# EAGLE design BYOB-BoosterPack-Template (EAGLE 6.5.0)
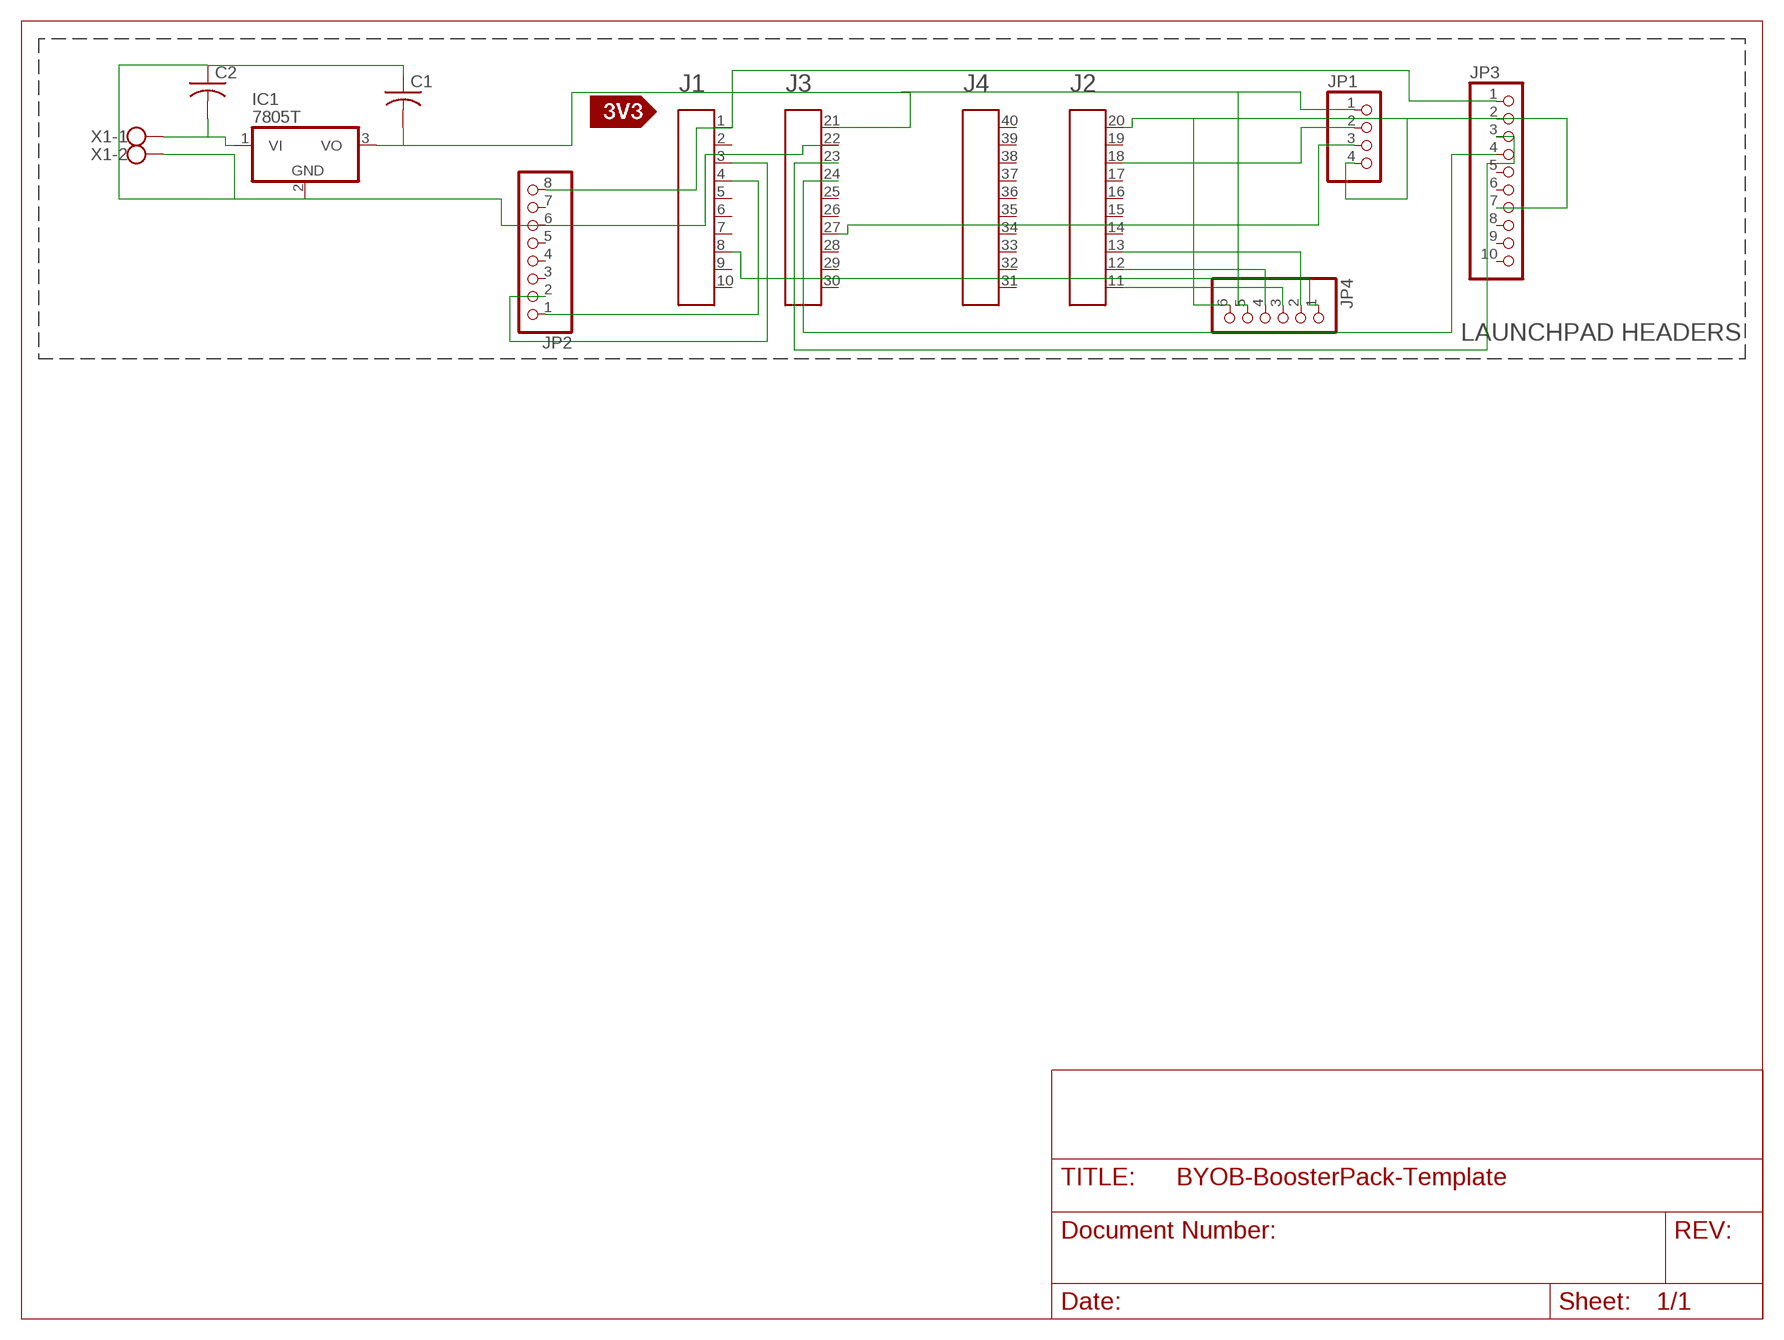
[diagram p0: schematic, sheet 1]

## Parts
A1  HEADER4X10-BOOSTERPACK  [4X10-BOOSTERPACK]
C1  C-US025-025X050  [C025-025X050]
C2  C-US025-025X050  [C025-025X050]
IC1  7805T  [TO220H]
JP1  PINHD-1X4  [1X04]
JP2  PINHD-1X8  [1X08]
JP3  PINHD-1X10  [1X10]
JP4  PINHD-1X6  [1X06]
U$3  SILK_3V3_TAG  [SILK_3V3_TAG]
X1  W237-102  [W237-102]

## Nets
GND: A1.20 A1.22 C1.1 C2.1 IC1.2(GND) JP1.4 JP2.6 JP3.2 JP3.7 JP4.6 X1.2
N$1: A1.21 C1.2 IC1.3(VO) JP1.1 JP4.5
N$2: A1.4 JP2.1
N$3: A1.18 JP1.2
N$4: A1.27 JP1.3
N$6: A1.1 JP2.8 JP3.1
N$7: A1.3 JP2.2
N$9: A1.24 JP3.4
N$10: A1.23 JP3.3
N$11: A1.12 JP4.4
N$12: A1.11 JP4.3
N$13: A1.13 JP4.2
N$14: A1.8 JP4.1
N$16: C2.2 IC1.1(VI) X1.1
Unconnected: A1.2 A1.5 A1.6 A1.7 A1.9 A1.10 A1.14 A1.15 A1.16 A1.17 A1.19 A1.25 A1.26 A1.28 A1.29 A1.30 A1.31 A1.32 A1.33 A1.34 A1.35 A1.36 A1.37 A1.38 A1.39 A1.40 JP2.3 JP2.4 JP2.5 JP2.7 JP3.5 JP3.6 JP3.8 JP3.9 JP3.10

## Notes on the sheet
- LAUNCHPAD HEADERS

## Library data of the parts
A1 = Public_BP_Library:HEADER4X10-BOOSTERPACK
C1 C2 = adafruit:C-US: CAPACITOR, American symbol
IC1 = adafruit:78*: Positive VOLTAGE REGULATOR Added bigger pads to the TO-92 package
JP1 = pinhead:PINHD-1X4: PIN HEADER
JP2 = pinhead:PINHD-1X8: PIN HEADER
JP3 = pinhead:PINHD-1X10: PIN HEADER
JP4 = pinhead:PINHD-1X6: PIN HEADER
U$3 = Public_BP_Library:SILK_3V3_TAG
X1 = con-wago-500:W237-102: WAGO SCREW CLAMP; MPN: 237-102; OC_FARNELL: unknown; OC_NEWARK: 70K9898

## Board
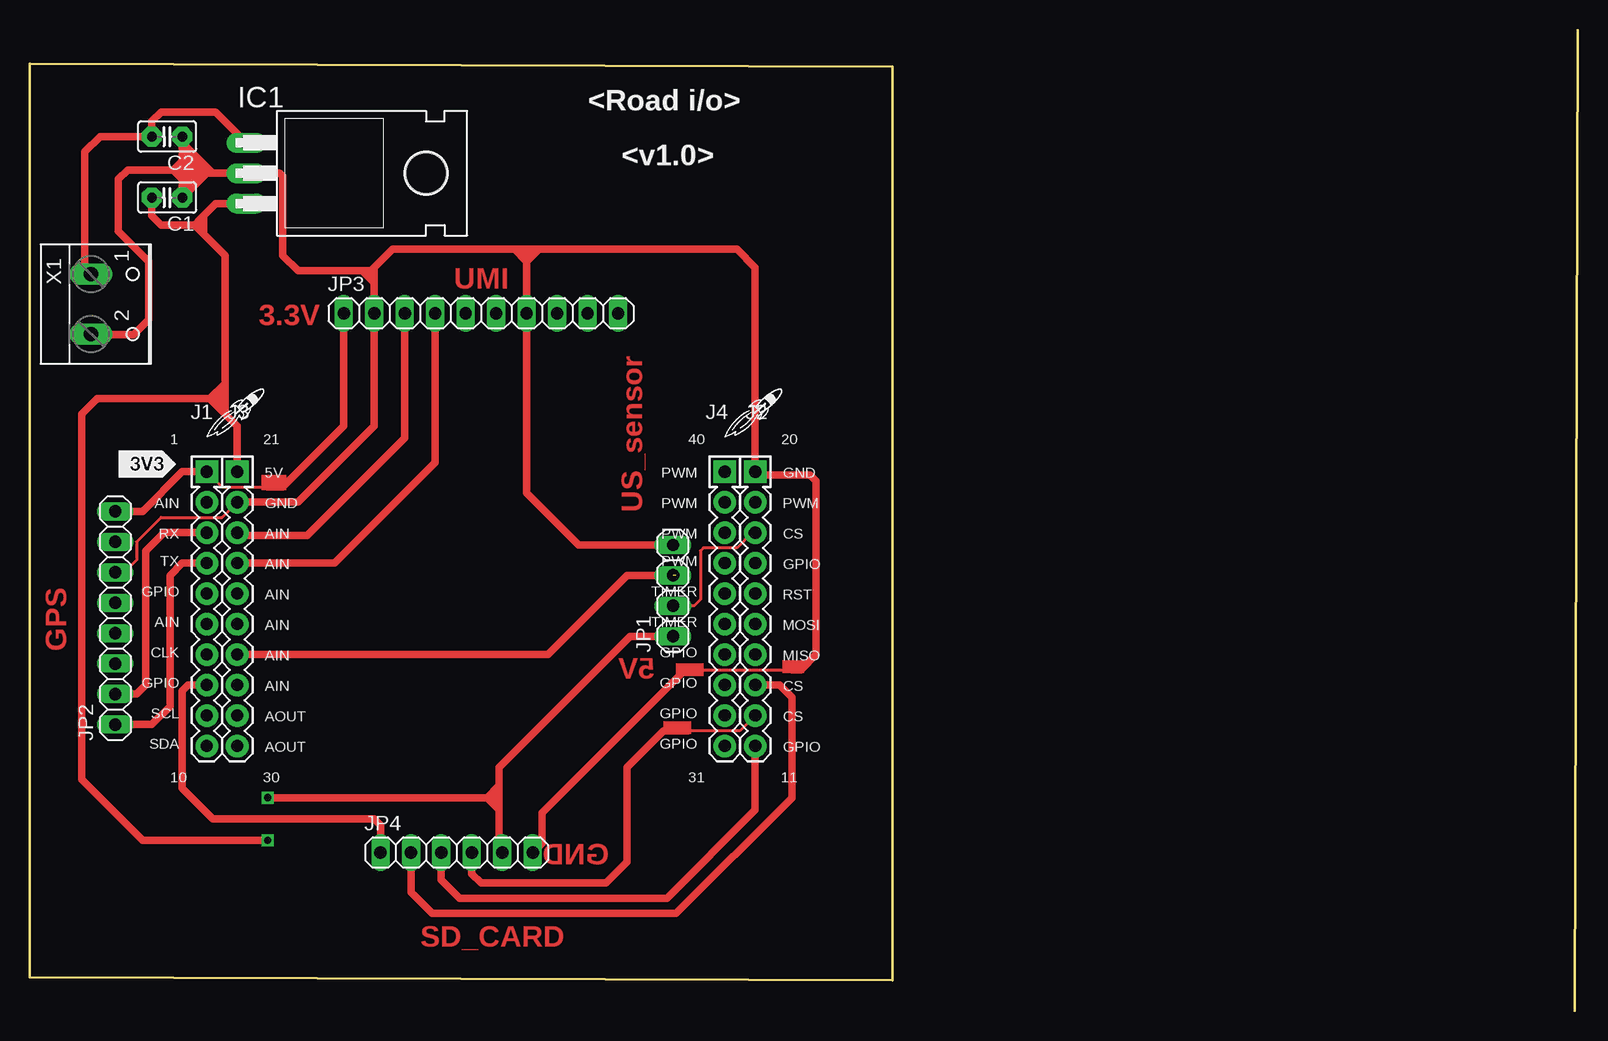
[diagram p1: board, top side]
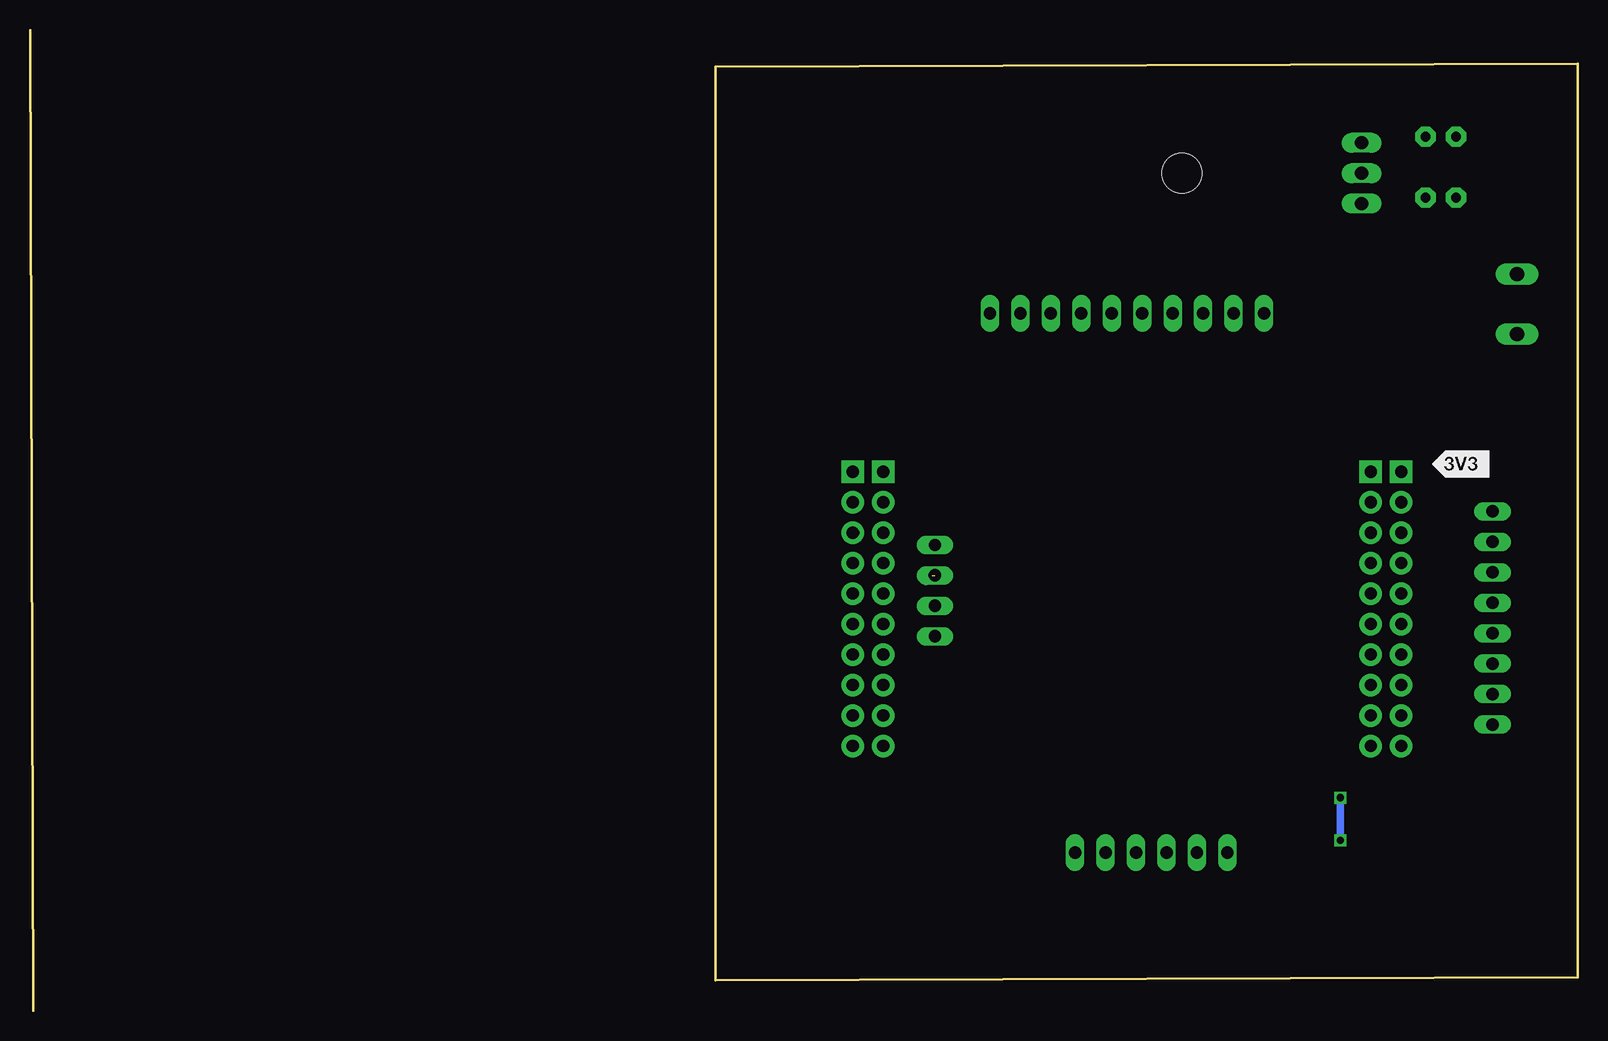
[diagram p2: board, bottom side, seen from below]

Size 129.03 x 81.79 mm. Coordinates in mm from the lower left corner, seen from the top.
Outline: 128.78,0 129.03,81.79
Outline: 0,2.79 71.88,2.54 71.88,78.74 0,78.99 0,2.79
Copper layers (1*16): Top 0.035mm / dielectric 1.5mm / Bottom 0.035mm
Design rules "default": minimum track width 10mil, minimum drill 24mil, track to track 8mil, track to pad 8mil, pad to pad 8mil, via to via 8mil, smd to smd 8mil, copper to edge 40mil, drill to drill 8mil, minimum pad ring 10mil, minimum via ring 8mil, stop-mask expansion 4mil, vias tented up to drill 0mil, thermal gap 10mil

### Footprints (pad centres in the part's own frame; a part is rotated, then mirrored left to right if it is on the bottom)
4X10-BOOSTERPACK = drill 1.016 pad 1.88 square: 1 0,10.16; 20 45.72,10.16; 21 2.54,10.16; 40 43.18,10.16 | drill 1.016 pad 1.88: 2 0,7.62; 3 0,5.08; 4 0,2.54; 5 0,0; 6 0,-2.54; 7 0,-5.08; 8 0,-7.62; 9 0,-10.16; 10 0,-12.7; 11 45.72,-12.7; 12 45.72,-10.16; 13 45.72,-7.62; 14 45.72,-5.08; 15 45.72,-2.54; 16 45.72,0; 17 45.72,2.54; 18 45.72,5.08; 19 45.72,7.62; 22 2.54,7.62; 23 2.54,5.08; 24 2.54,2.54; 25 2.54,0; 26 2.54,-2.54; 27 2.54,-5.08; 28 2.54,-7.62; 29 2.54,-10.16; 30 2.54,-12.7; 31 43.18,-12.7; 32 43.18,-10.16; 33 43.18,-7.62; 34 43.18,-5.08; 35 43.18,-2.54; 36 43.18,0; 37 43.18,2.54; 38 43.18,5.08; 39 43.18,7.62
C025-025X050 = drill 0.813 pad 1.676 octagon: 1 -1.27,0; 2 1.27,0
TO220H = drill 1.118 long: 1 -2.54,-10.16; 2 0,-10.16; 3 2.54,-10.16 | hole 3.302: 0,4.826
1X04 = drill 1.016 long: 1 -3.81,0; 2 -1.27,0; 3 1.27,0; 4 3.81,0
1X08 = drill 1.016 long: 1 -8.89,0; 2 -6.35,0; 3 -3.81,0; 4 -1.27,0; 5 1.27,0; 6 3.81,0; 7 6.35,0; 8 8.89,0
1X10 = drill 1.016 long: 1 -11.43,0; 2 -8.89,0; 3 -6.35,0; 4 -3.81,0; 5 -1.27,0; 6 1.27,0; 7 3.81,0; 8 6.35,0; 9 8.89,0; 10 11.43,0
1X06 = drill 1.016 long: 1 -6.35,0; 2 -3.81,0; 3 -1.27,0; 4 1.27,0; 5 3.81,0; 6 6.35,0
W237-102 = drill 1.194 long: 1 -2.5,-1.27; 2 2.5,-1.27

### Placement (x,y rotation side)
A1  14.73,34.8 0 top
C1  11.43,67.82 180 top
C2  11.43,72.9 180 top
IC1  28.19,69.85 270 top
JP1  53.59,35.05 90 top
JP2  7.11,32.77 90 top
JP3  37.59,58.17 0 top
JP4  35.56,13.21 0 top
U$1  [LOGO-ROCKET]  60.45,50.04 0 top
U$2  [LOGO-ROCKET]  17.27,50.04 0 top
U$3  7.37,44.45 0 top
X1  6.35,58.93 270 top

### Tracks (layer width: path | path; a pad name or v marks a point on that pad's centre or on a via)
GND
  Top 0.254: 7.87,36.58 8.89,37.59 8.89,39.12 10.92,41.15 16,41.15 A1.22 | 54.61,28.45 63.5,28.45
  Top 0.61: A1.22 22.35,42.42 28.7,48.77 JP3.2 | JP1.4 45.72,38.86 41.4,43.18 JP3.7 41.4,62.48 | JP4.6 42.67,13.97 42.67,16.51 54.61,28.45 | 63.5,28.45 64.26,28.45 65.53,29.72 65.53,44.2 65.02,44.7 60.71,44.7 A1.20 60.45,61.98 58.93,63.5 42.42,63.5 | 40.39,63.5 30.23,63.5 28.7,61.98 | 40.39,63.5 41.4,62.48 | 15.24,69.85 IC1.2 20.83,69.85 21.08,69.6 21.08,62.99 22.35,61.72 27.69,61.72 | 15.24,69.85 14.73,69.85 C1.1 12.7,69.34 | C2.1 12.7,72.39 | 12.7,72.39 13.21,71.88 | 13.21,71.88 15.24,69.85 | 12.7,69.34 11.94,70.1 | 11.94,70.1 8.13,70.1 7.37,69.34 7.37,65.02 9.91,62.48 9.91,57.66 8.64,56.39 5.12,56.39 X1.2 | 27.69,61.72 28.7,60.71 JP3.2 | JP3.2 28.7,61.98 | 27.69,61.72 28.45,61.72 28.7,61.98 | 12.7,72.39 12.7,70.87 | 12.7,70.87 12.7,70.1 | 12.7,70.1 12.7,69.34 | 13.21,71.88 13.21,68.58 12.95,68.33 | 11.94,70.1 12.7,70.1 | 11.94,70.1 12.7,70.87 | 41.4,62.48 42.42,63.5 | 40.39,63.5 41.4,63.5 | 41.4,63.5 42.42,63.5 | 41.4,63.5 41.4,62.74 | 7.87,36.58 JP2.6
N$1  (via drill 0.6)
  Top 0.61: JP1.1 50.04,31.24 39.12,20.32 39.12,18.8 | 16.26,49.78 17.27,48.77 A1.21 | 16.26,49.78 14.99,51.05 | 14.99,51.05 5.59,51.05 4.32,49.78 4.32,19.3 9.4,14.22 v19.81,14.22 | C1.2 10.16,66.29 10.92,65.53 13.72,65.53 | 13.72,65.53 14.22,66.04 | 14.22,66.04 14.48,66.29 | 14.48,66.29 15.49,67.31 IC1.3 | 14.99,51.05 16.26,52.32 | 16.26,52.32 16.26,62.99 14.48,64.77 | 14.22,65.02 13.72,65.53 | 39.12,17.78 39.12,18.8 | 39.12,17.78 39.12,16.76 | 39.12,16.76 39.12,13.46 JP4.5 | 14.22,66.04 14.22,65.02 | 14.22,65.02 14.48,64.77 | 14.48,64.77 14.48,66.29 | 16.26,52.32 16.26,49.78 | v19.81,17.78 38.1,17.78 | 38.1,17.78 39.12,17.78 | 38.1,17.78 39.12,18.8 | 38.1,17.78 39.12,16.76
  Bottom 0.61: v19.81,14.22 v19.81,17.78
N$2
  Top 0.61: JP2.1 10.16,23.88 11.68,25.4 11.68,36.32 12.7,37.34 A1.4
N$3  (via drill 0.6)
  Top 0.254: v60.2,39.88 58.93,38.61 56.13,38.61 55.88,38.35 55.88,34.29 55.37,33.78 JP1.2
  Bottom 0.254: A1.18 v60.2,39.88
N$4  (via drill 0.6)  (1 unrouted)
  Top 0.61: A1.27 43.18,29.72 49.78,36.32 v53.85,36.32
  Bottom 0.61: v53.85,36.32 54.36,35.81
N$5
  Top 0.61: 13.46,71.12 13.46,68.83
N$6
  Top 0.254: A1.1 16,43.69 19.81,43.69
  Top 0.61: JP2.8 9.4,41.66 12.7,44.96 A1.1 | 19.81,43.69 21.08,43.69 26.16,48.77 JP3.1
N$7
  Top 0.61: JP2.2 8.89,26.42 9.65,27.18 9.65,38.35 11.18,39.88 A1.3
N$8
  Top 0.61: 13.72,70.87 13.72,69.09
N$9
  Top 0.61: JP3.4 33.78,45.72 25.4,37.34 A1.24
N$10
  Top 0.61: JP3.3 31.24,47.75 23.11,39.62 17.53,39.62 A1.23
N$11
  Top 0.254: A1.12 59.18,23.37 54.86,23.37
  Top 0.61: 54.86,23.37 52.83,23.37 49.78,20.32 49.78,12.45 48.01,10.67 37.59,10.67 36.83,11.43 JP4.4
N$12
  Top 0.61: 34.29,13.97 JP4.3 34.29,10.92 35.81,9.4 53.09,9.4 60.45,16.76 A1.11
N$13
  Top 0.61: A1.13 62.48,27.18 63.5,26.16 63.5,17.78 53.85,8.13 33.53,8.13 31.75,9.91 JP4.2
N$14
  Top 0.61: A1.8 13.21,27.18 12.7,26.67 12.7,18.54 15.24,16 28.7,16 29.21,15.49 JP4.1
N$15
  Top 0.61: 13.97,70.87 13.97,70.61 13.97,70.36 | 13.97,70.36 13.97,69.6 | 13.97,70.36 14.48,69.85
N$16
  Top 0.61: IC1.1 15.49,74.93 10.92,74.93 10.16,74.17 C2.2 5.84,72.9 4.57,71.63 4.57,61.94 X1.1
N$17
  Top 0.61: 16,51.82 16,50.29
N$18
  Top 0.61: 15.75,51.56 15.75,51.31 15.49,51.05
N$19
  Top 0.61: 15.75,50.8 15.75,50.55
(copper drawn outside any net)
  shapes: Top area x5

### Text on the board
Top: IMU | 3.3V | US_sensor | GPS | 5V | GND | SD_CARD
tPlace: <Road i/o> | <v1.0>